# EAGLE design pca9306d_breakout (EAGLE 5.11)
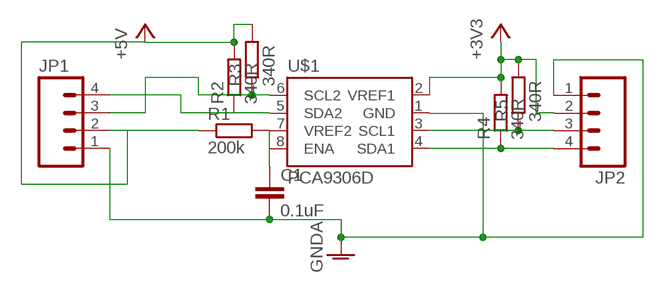
[diagram p0: schematic, sheet 1]

## Parts
C1  0.1uF  C2.5/2  [C2.5-2]
JP1  M04LONGPADS  [1X04_LONGPADS]
JP2  M04LONGPADS  [1X04_LONGPADS]
R1  200k  R-EU_0204/7  [0204/7]
R2  340R  R-EU_0204/7  [0204/7]
R3  340R  R-EU_0204/7  [0204/7]
R4  340R  R-EU_0204/7  [0204/7]
R5  340R  R-EU_0204/7  [0204/7]
U$1  PCA9306D  [SO08]

## Nets
+3V3: JP2.2 R4.2 R5.2 U$1.2(VREF1)
+5V: JP1.2 R1.1 R2.2 R3.2
ENA: C1.1 R1.2 U$1.7(VREF2) U$1.8(ENA)
GNDA: C1.2 JP1.1 JP2.1 U$1.1(GND)
SCL1: JP2.3 R5.1 U$1.3(SCL1)
SCL2: JP1.3 R3.1 U$1.6(SCL2)
SDA1: JP2.4 R4.1 U$1.4(SDA1)
SDA2: JP1.4 R2.1 U$1.5(SDA2)

## Library data of the parts
C1 = capacitor-wima:C: CAPACITOR naming: grid - package width
JP1 JP2 = SparkFun:M04: Header 4 Standard 4-pin 0.1" header. Use with straight break away headers (SKU : PRT-00116), right angle break away headers (PRT-00553), swiss pins (PRT-00743), machine pins (PRT-00117), and female headers (PRT-00115). Molex polarized connector foot print use with SKU : PRT-08231 with associated crimp pins and housings.
R1-R5 = rcl:R-EU_: RESISTOR, European symbol
U$1 = mine:PCA9306D

## Board
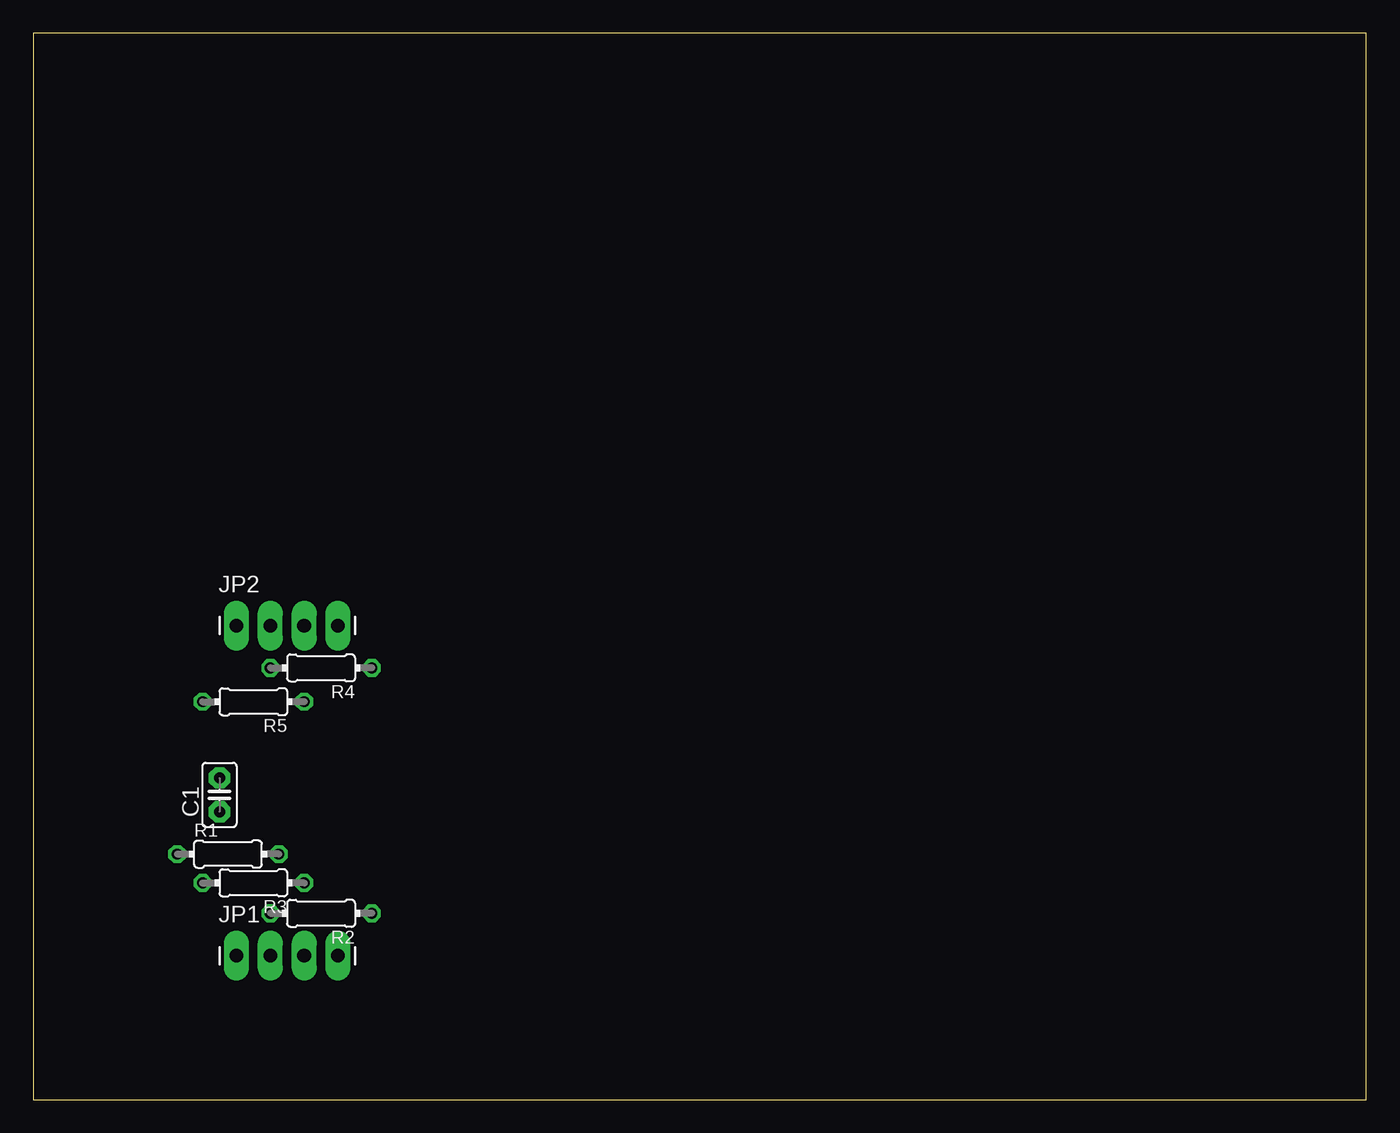
[diagram p1: board, top side]
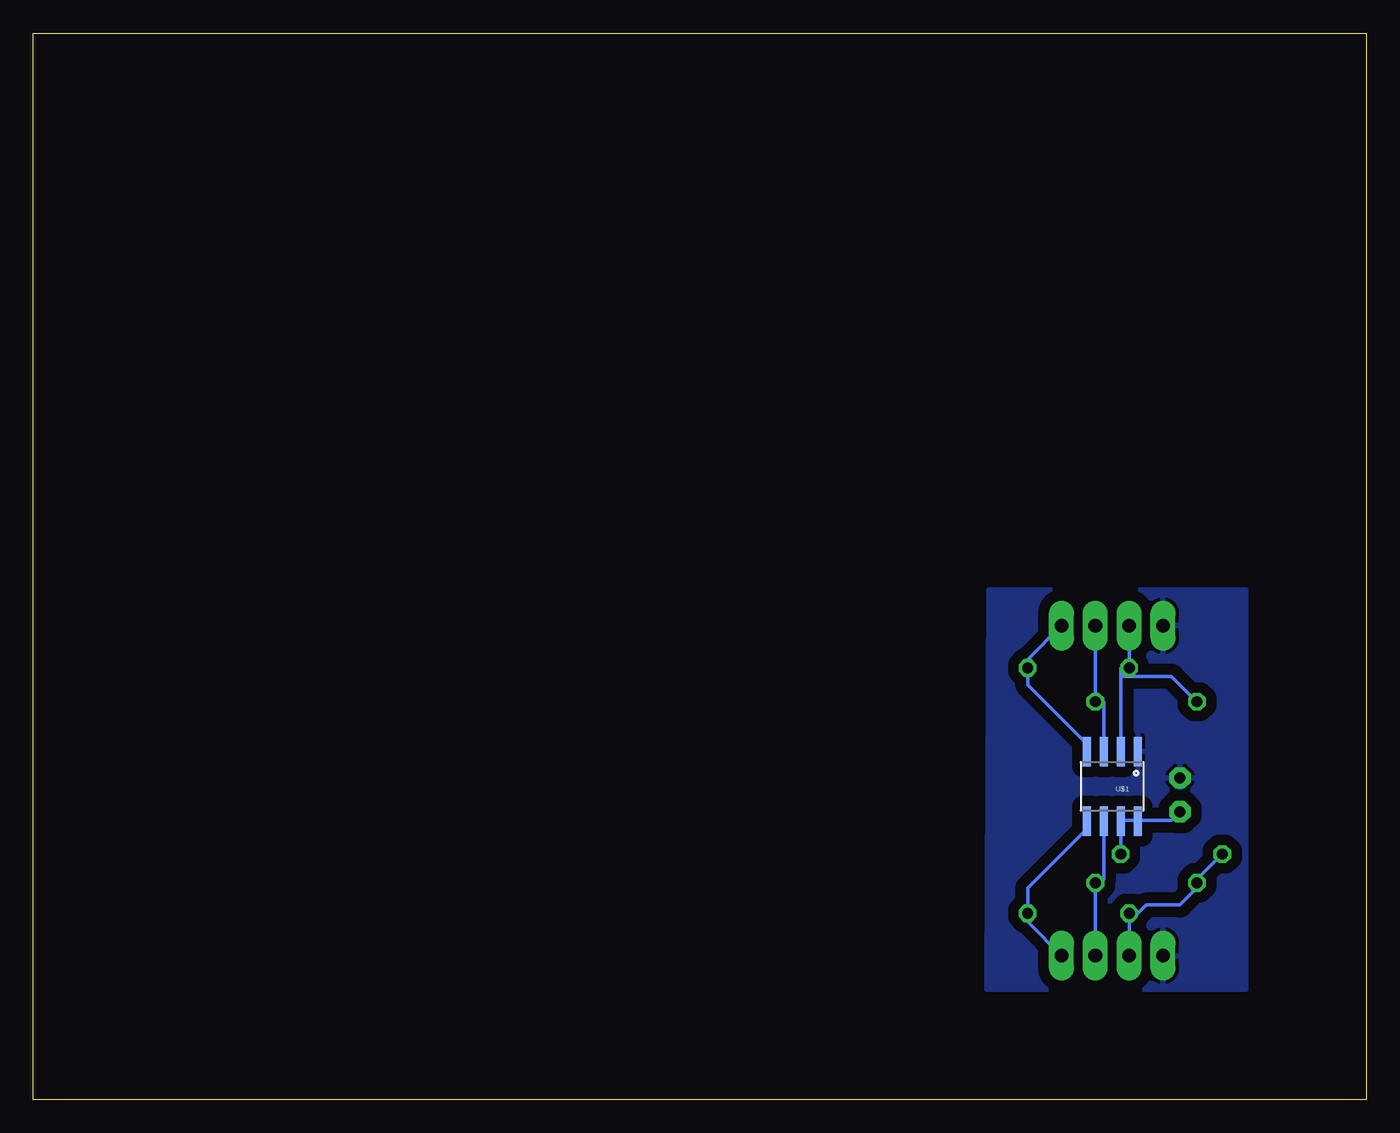
[diagram p2: board, bottom side, seen from below]

Size 100 x 80 mm. Coordinates in mm from the lower left corner, seen from the top.
Outline: 0,0 100,0 100,80 0,80 0,0
Copper layers (1*16): Top 0.035mm / dielectric 1.5mm / Bottom 0.035mm
Design rules "default": minimum track width 10mil, minimum drill 24mil, track to track 8mil, track to pad 8mil, pad to pad 8mil, via to via 8mil, smd to smd 8mil, copper to edge 40mil, drill to drill 8mil, minimum pad ring 10mil, minimum via ring 8mil, stop-mask expansion 4mil, vias tented up to drill 0mil, thermal gap 10mil

### Footprints (pad centres in the part's own frame; a part is rotated, then mirrored left to right if it is on the bottom)
C2.5-2 = drill 0.813 pad 1.6 octagon: 1 -1.27,0; 2 1.27,0
1X04_LONGPADS = drill 1.016 pad 1.88 long: 1 0,0; 2 2.54,0; 3 5.08,0; 4 7.62,0
0204/7 = drill 0.813 octagon: 1 -3.81,0; 2 3.81,0
SO08 = smd 0.61 x 2.21: 1 -1.905,-2.616; 2 -0.635,-2.616; 3 0.635,-2.616; 4 1.905,-2.616; 5 1.905,2.616; 6 0.635,2.616; 7 -0.635,2.616; 8 -1.905,2.616

### Placement (x,y rotation side)
C1  13.97,22.86 90 top
JP1  15.24,10.79 0 top
JP2  15.24,35.56 0 top
R1  14.61,18.41 0 top
R2  21.59,13.97 180 top
R3  16.51,16.26 180 top
R4  21.59,32.38 180 top
R5  16.51,29.84 180 top
U$1  19.05,23.5 180 bottom

### Tracks (layer width: path | path; a pad name or v marks a point on that pad's centre or on a via)
+3V3
  Bottom 0.254: 18.41,31.75 18.41,32.38 R4.2 JP2.2 | 18.41,31.75 U$1.2 | R5.2 14.61,31.75 18.41,31.75
+5V
  Bottom 0.254: R1.1 12.7,16.51 R3.2 12.7,15.88 13.97,14.61 16.51,14.61 17.14,13.97 R2.2 JP1.2
ENA
  Bottom 0.254: 17.14,20.95 18.41,20.95 U$1.7 R1.2 | C1.1 14.61,20.95 17.14,20.95 | 17.14,20.95 U$1.8
GNDA
  pour Bottom (isolate 0.813): 9.02,38.23 9.02,8.26 28.45,8.26 28.45,8.89 28.32,38.23
SCL1
  Bottom 0.254: U$1.3 19.68,29.84 R5.1 JP2.3
SCL2
  Bottom 0.254: U$1.6 19.68,16.51 20.32,16.51 R3.1 JP1.3
SDA1
  Bottom 0.254: U$1.4 20.95,26.67 25.4,31.11 R4.1 25.4,33.02 JP2.4
SDA2
  Bottom 0.254: U$1.5 20.95,20.32 25.4,15.88 R2.1 25.4,13.34 JP1.4